# EAGLE schematic SmartMailbox (EAGLE 6.4)
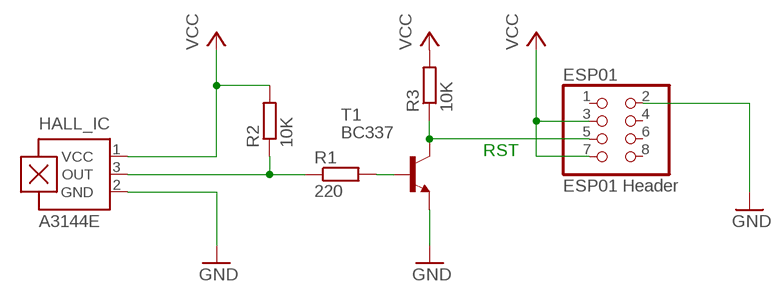
[diagram p0: schematic, sheet 1]

## Parts
ESP01  ESP01 Header  PINHD-2X4  [2X04]
HALL_IC  A3144E  A1301UA  [SIP3-UA]
R1  220  R-EU_0204/2V  [0204V]
R2  10K  R-EU_0204/2V  [0204V]
R3  10K  R-EU_0204/2V  [0204V]
T1  BC337  2N2222  [TO92-EBC-OVAL]

## Nets
GND: ESP01.2 HALL_IC.2(GND) T1.E
N$3: HALL_IC.3(OUT) R1.1 R2.1
N$4: R1.2 T1.B
N$6: ESP01.5 R3.1 T1.C
VCC: ESP01.3 ESP01.7 HALL_IC.1(VCC) R2.2 R3.2
Unconnected: ESP01.1 ESP01.4 ESP01.6 ESP01.8

## Notes on the sheet
- RST

## Library data of the parts
ESP01 = adafruit:PINHD-2X4: PIN HEADER
HALL_IC = allegro:A13*?: Linear Hall Effect Sensor ICs Continuous-Time Ratiometric High-Temperature Operation Programmable Linear with Analog Output A1302 -Replacement- UGN3503 Source: http://www.allegromicro.com/en/Products/Part_Numbers/1301/1301.pdf http://www.allegromicro.com/en/Products/Part_Numbers/1321/1321.pdf http://www.allegromicro.com/en/Products/Part_Numbers/1381/1381.pdf; MF: ALLEGRO MICROSYSTEMS, INC.; MPN: A1301EUA-T; OC_FARNELL: 1198085; OC_NEWARK: 31K6635
R1-R3 = rcl:R-EU_: RESISTOR, European symbol
T1 = adafruit:2N2222: NPN TRANSISTOR Big oval pads